# EAGLE design panel (EAGLE 9.6.1)
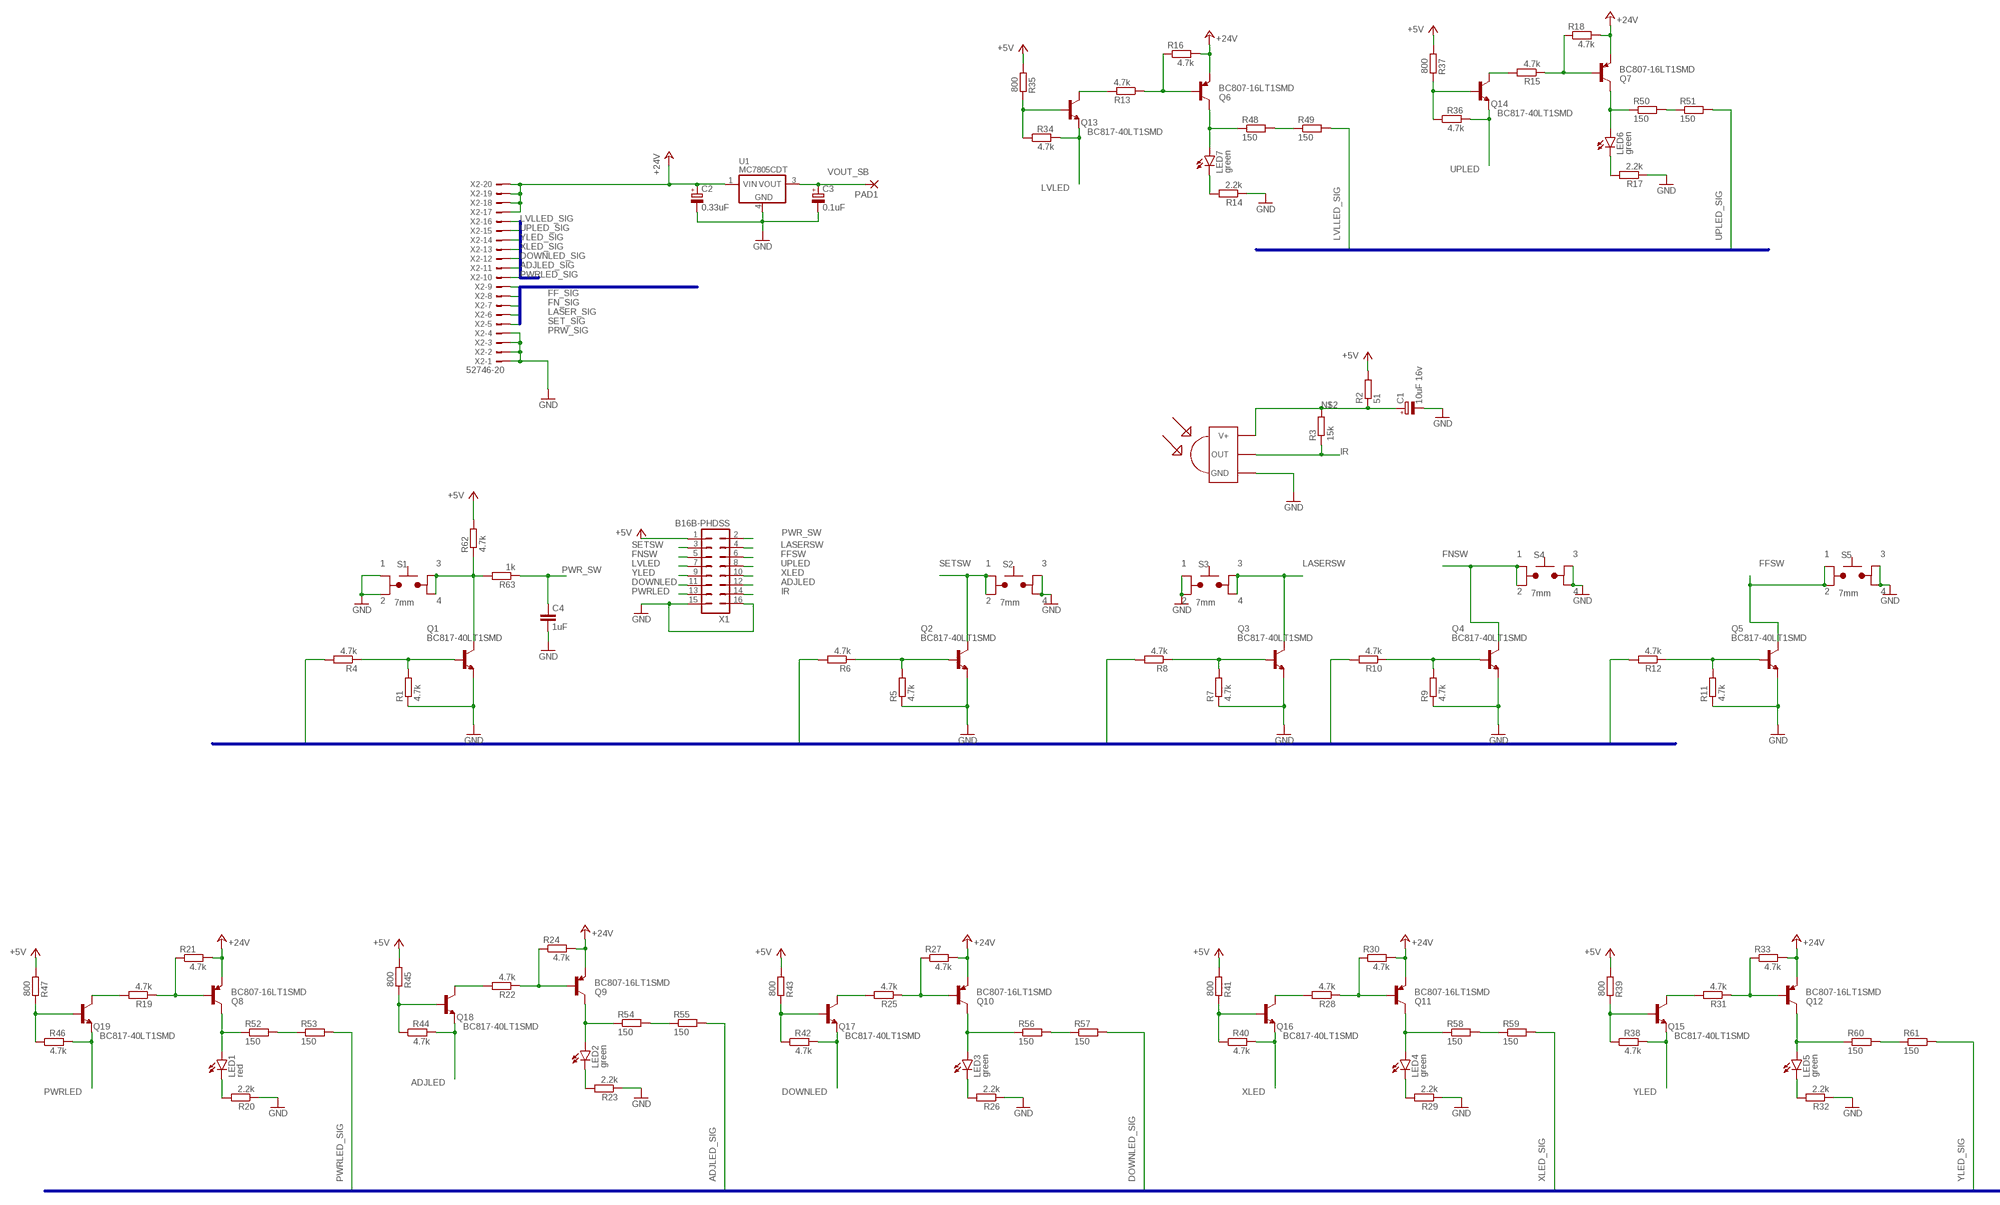
[diagram p0: schematic, sheet 1]

## Parts
C1  10uF 16v  CPOL-EUCT3216  [CT3216]
C2  0.33uF  CPOL-EUCT3216  [CT3216]
C3  0.1uF  CPOL-EUCT3216  [CT3216]
C4  1uF  C-EUC0805  [C0805]
LED1  red  LEDRED_3MM  [LED_RED_3MM]
LED2  green  LEDGREEN_3MM  [LED_GREEN_3MM]
LED3  green  LEDGREEN_3MM  [LED_GREEN_3MM]
LED4  green  LEDGREEN_3MM  [LED_GREEN_3MM]
LED5  green  LEDGREEN_3MM  [LED_GREEN_3MM]
LED6  green  LEDGREEN_3MM  [LED_GREEN_3MM]
LED7  green  LEDGREEN_3MM  [LED_GREEN_3MM]
PAD1  1,6/0,8  [1,6/0,8]
Q1  BC817-40LT1SMD  [SOT23-BEC]
Q2  BC817-40LT1SMD  [SOT23-BEC]
Q3  BC817-40LT1SMD  [SOT23-BEC]
Q4  BC817-40LT1SMD  [SOT23-BEC]
Q5  BC817-40LT1SMD  [SOT23-BEC]
Q6  BC807-16LT1SMD  [SOT23]
Q7  BC807-16LT1SMD  [SOT23]
Q8  BC807-16LT1SMD  [SOT23]
Q9  BC807-16LT1SMD  [SOT23]
Q10  BC807-16LT1SMD  [SOT23]
Q11  BC807-16LT1SMD  [SOT23]
Q12  BC807-16LT1SMD  [SOT23]
Q13  BC817-40LT1SMD  [SOT23-BEC]
Q14  BC817-40LT1SMD  [SOT23-BEC]
Q15  BC817-40LT1SMD  [SOT23-BEC]
Q16  BC817-40LT1SMD  [SOT23-BEC]
Q17  BC817-40LT1SMD  [SOT23-BEC]
Q18  BC817-40LT1SMD  [SOT23-BEC]
Q19  BC817-40LT1SMD  [SOT23-BEC]
R1  4.7k  R-EU_R0805  [R0805]
R2  51  R-EU_R0805  [R0805]
R3  15k  R-EU_R0805  [R0805]
R4  4.7k  R-EU_R0805  [R0805]
R5  4.7k  R-EU_R0805  [R0805]
R6  4.7k  R-EU_R0805  [R0805]
R7  4.7k  R-EU_R0805  [R0805]
R8  4.7k  R-EU_R0805  [R0805]
R9  4.7k  R-EU_R0805  [R0805]
R10  4.7k  R-EU_R0805  [R0805]
R11  4.7k  R-EU_R0805  [R0805]
R12  4.7k  R-EU_R0805  [R0805]
R13  4.7k  R-EU_R0805  [R0805]
R14  2.2k  R-EU_R0805  [R0805]
R15  4.7k  R-EU_R0805  [R0805]
R16  4.7k  R-EU_R0805  [R0805]
R17  2.2k  R-EU_R0805  [R0805]
R18  4.7k  R-EU_R0805  [R0805]
R19  4.7k  R-EU_R0805  [R0805]
R20  2.2k  R-EU_R0805  [R0805]
R21  4.7k  R-EU_R0805  [R0805]
R22  4.7k  R-EU_R0805  [R0805]
R23  2.2k  R-EU_R0805  [R0805]
R24  4.7k  R-EU_R0805  [R0805]
R25  4.7k  R-EU_R0805  [R0805]
R26  2.2k  R-EU_R0805  [R0805]
R27  4.7k  R-EU_R0805  [R0805]
R28  4.7k  R-EU_R0805  [R0805]
R29  2.2k  R-EU_R0805  [R0805]
R30  4.7k  R-EU_R0805  [R0805]
R31  4.7k  R-EU_R0805  [R0805]
R32  2.2k  R-EU_R0805  [R0805]
R33  4.7k  R-EU_R0805  [R0805]
R34  4.7k  R-EU_R0805  [R0805]
R35  800  R-EU_R0805  [R0805]
R36  4.7k  R-EU_R0805  [R0805]
R37  800  R-EU_R0805  [R0805]
R38  4.7k  R-EU_R0805  [R0805]
R39  800  R-EU_R0805  [R0805]
R40  4.7k  R-EU_R0805  [R0805]
R41  800  R-EU_R0805  [R0805]
R42  4.7k  R-EU_R0805  [R0805]
R43  800  R-EU_R0805  [R0805]
R44  4.7k  R-EU_R0805  [R0805]
R45  800  R-EU_R0805  [R0805]
R46  4.7k  R-EU_R0805  [R0805]
R47  800  R-EU_R0805  [R0805]
R48  150  R-EU_R2512  [R2512]
R49  150  R-EU_R2512  [R2512]
R50  150  R-EU_R2512  [R2512]
R51  150  R-EU_R2512  [R2512]
R52  150  R-EU_R2512  [R2512]
R53  150  R-EU_R2512  [R2512]
R54  150  R-EU_R2512  [R2512]
R55  150  R-EU_R2512  [R2512]
R56  150  R-EU_R2512  [R2512]
R57  150  R-EU_R2512  [R2512]
R58  150  R-EU_R2512  [R2512]
R59  150  R-EU_R2512  [R2512]
R60  150  R-EU_R2512  [R2512]
R61  150  R-EU_R2512  [R2512]
R62  4.7k  R-EU_R0805  [R0805]
R63  1k  R-EU_R0805  [R0805]
S1  7mm  TL11057MM  [TL1105F]
S2  7mm  TL11057MM  [TL1105F]
S3  7mm  TL11057MM  [TL1105F]
S4  7mm  TL11057MM  [TL1105F]
S5  7mm  TL11057MM  [TL1105F]
U1  MC7805CDT  [DPAK-3]
U$1  TSOP4838FLAT  [HDRVR14W64P250_1X14_2266X508X754B]
X1  B16B-PHDSS  [B16B-PHDSS]
X2  52746-20  [52746-20]

## Nets
+5V: R2.2 R35.1 R37.1 R39.1 R41.1 R43.1 R45.1 R47.1 R62.2 X1.1
+24V: C2.+ Q6.2(E) Q7.2(E) Q8.2(E) Q9.2(E) Q10.2(E) Q11.2(E) Q12.2(E) R16.2 R18.2 R21.2 R24.2 R27.2 R30.2 R33.2 U1.1(VIN) X2.17 X2.18 X2.19 X2.20
ADJLED [signal]: Q18.E R44.2 X1.12
ADJLED_SIG: R55.2 X2.11
DOWNLED [signal]: Q17.E R42.2 X1.11
DOWNLED_SIG: R57.2 X2.12
FF_SIG: R12.2 X2.9
FFSW [signal]: Q5.C S5.1 S5.3 X1.6
FN_SIG: R10.2 X2.8
FNSW [signal]: Q4.C S4.1 S4.3 X1.5
GND [supply]: C1.- C2.- C3.- C4.2 Q1.E Q2.E Q3.E Q4.E Q5.E R1.1 R5.1 R7.1 R9.1 R11.1 R14.1 R17.1 R20.1 R23.1 R26.1 R29.1 R32.1 S1.1 S1.3 S2.2 S2.4 S3.1 S3.3 S4.2 S4.4 S5.2 S5.4 U1.4(GND) U$1.GND X1.15 X1.16 X2.1 X2.2 X2.3 X2.4
IR [signal]: R3.1 U$1.OUT X1.14
LASER_SIG: R8.2 X2.7
LASERSW [signal]: Q3.C S3.2 S3.4 X1.4
LVLED [signal]: Q13.E R34.2 X1.7
LVLLED_SIG: R49.2 X2.16
N$1: Q1.B R1.2 R4.1
N$2: C1.+ R2.1 R3.2 U$1.VCC(V+)
N$3: LED7.A Q6.3(C) R48.1
N$4: Q2.B R5.2 R6.1
N$5: Q3.B R7.2 R8.1
N$6: Q4.B R9.2 R10.1
N$7: Q5.B R11.2 R12.1
N$8: Q6.1(B) R13.1 R16.1
N$9: Q13.C R13.2
N$10: LED7.K(C) R14.2
N$11: Q14.B R36.1 R37.2
N$12: Q7.1(B) R15.1 R18.1
N$13: LED6.K(C) R17.2
N$14: Q8.1(B) R19.1 R21.1
N$15: LED1.K(C) R20.2
N$16: Q9.1(B) R22.1 R24.1
N$17: LED2.K(C) R23.2
N$18: Q10.1(B) R25.1 R27.1
N$19: LED3.K(C) R26.2
N$20: Q11.1(B) R28.1 R30.1
N$21: LED4.K(C) R29.2
N$22: Q12.1(B) R31.1 R33.1
N$23: LED5.K(C) R32.2
N$24: Q13.B R34.1 R35.2
N$25: Q14.C R15.2
N$26: Q15.B R38.1 R39.2
N$27: Q15.C R31.2
N$28: Q16.B R40.1 R41.2
N$29: Q16.C R28.2
N$30: Q17.B R42.1 R43.2
N$31: Q17.C R25.2
N$32: Q18.B R44.1 R45.2
N$33: Q18.C R22.2
N$34: Q19.B R46.1 R47.2
N$35: Q19.C R19.2
N$36: R48.2 R49.1
N$37: LED6.A Q7.3(C) R50.1
N$38: R50.2 R51.1
N$39: LED1.A Q8.3(C) R52.1
N$40: R52.2 R53.1
N$41: LED2.A Q9.3(C) R54.1
N$42: R54.2 R55.1
N$43: LED3.A Q10.3(C) R56.1
N$44: R56.2 R57.1
N$45: LED4.A Q11.3(C) R58.1
N$46: R58.2 R59.1
N$47: LED5.A Q12.3(C) R60.1
N$48: R60.2 R61.1
N$49 [signal]: Q1.C R62.1 R63.2 S1.2 S1.4
PRW_SIG: R4.2 X2.5
PWR_SW [signal]: C4.1 R63.1 X1.2
PWRLED [signal]: Q19.E R46.2 X1.13
PWRLED_SIG: R53.2 X2.10
SET_SIG: R6.2 X2.6
SETSW [signal]: Q2.C S2.1 S2.3 X1.3
UPLED [signal]: Q14.E R36.2 X1.8
UPLED_SIG: R51.2 X2.15
VOUT_SB: C3.+ PAD1.1(P) U1.3(VOUT)
XLED [signal]: Q16.E R40.2 X1.10
XLED_SIG: R59.2 X2.13
YLED [signal]: Q15.E R38.2 X1.9
YLED_SIG: R61.2 X2.14

## Buses
B$1,FF_SIG,FN_SIG,LASER_SIG,PRW_SIG,SET_SIG
ADJLED_SIG,DOWNLED_SIG,LVLLED_SIG,PWRLED_SIG,UPLED_SIG,XLED_SIG,YLED_SIG
FF_SIG,FN_SIG,LASER_SIG,PRW_SIG,SET_SIG

## Library data of the parts
C1-C3 = rcl:CPOL-EU: POLARIZED CAPACITOR, European symbol; SPICEPREFIX: C
C4 = rcl:C-EU: CAPACITOR, European symbol; SPICEPREFIX: C
LED1-LED7 = led_user:LED: LED OSRAM: - CHIPLED LG R971, LG N971, LY N971, LG Q971, LY Q971, LO R971, LY R971 LH N974, LH R974 LS Q976, LO Q976, LY Q976 LO Q996 - Hyper CHIPLED LW Q18S LB Q993, LB Q99A, LB R99A - SideLED LS A670, LO A670, LY A670, LG A670, LP A670 LB A673, LV A673, LT A673, LW A673 LH A674 LY A675 LS A676, LA A676, LO A676, LY A676, LW A676 LS A679, LY A679, LG A679 - Hyper Micro SIDELED® LS Y876, LA Y876, LO Y876, LY Y876 LT Y87S - SmartLED LW L88C, LW L88S LB L89C, LB L89S, LG L890 LS L89K, LO L89K, LY L89K LS L896, LA L896, LO L896, LY L896 - TOPLED LS T670, LO T670, LY T670, LG T670, LP T670 LSG T670, LSP T670, LSY T670, LOP T670, LYG T670 LG T671, LOG T671, LSG T671 LB T673, LV T673, LT T673, LW T673 LH T674 LS T676, LA T676, LO T676, LY T676, LB T676, LH T676, LSB T676, LW T676 LB T67C, LV T67C, LT T67C, LS T67K, LO T67K, LY T67K, LW E67C LS E67B, LA E67B, LO E67B, LY E67B, LB E67C, LV E67C, LT E67C LW T67C LS T679, LY T679, LG T679 LS T770, LO T770, LY T770, LG T770, LP T770 LB T773, LV T773, LT T773, LW T773 LH T774 LS E675, LA E675, LY E675, LS T675 LS T776, LA T776, LO T776, LY T776, LB T776 LHGB T686 LT T68C, LB T68C - Hyper Mini TOPLED® LB M676 - Mini TOPLED Santana® LG M470 LS M47K, LO M47K, LY M47K Source: http://www.osram.convergy.de LUXEON: - LUMILED® LXK2-PW12-R00, LXK2-PW12-S00, LXK2-PW14-U00, LXK2-PW14-V00 LXK2-PM12-R00, LXK2-PM12-S00, LXK2-PM14-U00 LXK2-PE12-Q00, LXK2-PE12-R00, LXK2-PE12-S00, LXK2-PE14-T00, LXK2-PE14-U00 LXK2-PB12-K00, LXK2-PB12-L00, LXK2-PB12-M00, LXK2-PB14-N00, LXK2-PB14-P00, LXK2-PB14-Q00 LXK2-PR12-L00, LXK2-PR12-M00, LXK2-PR14-Q00, LXK2-PR14-R00 LXK2-PD12-Q00, LXK2-PD12-R00, LXK2-PD12-S00 LXK2-PH12-R00, LXK2-PH12-S00 LXK2-PL12-P00, LXK2-PL12-Q00, LXK2-PL12-R00 Source: www.luxeon.com KINGBRIGHT: KA-3528ASYC Source: www.kingbright.com
PAD1 = wirepad:1,6/0,8: THROUGH-HOLE PAD
Q1-Q5 Q13-Q19 = transistor-npn:BC817*: NPN Transistor
Q6-Q12 = transistor-pnp_user:BC807*: PNP Transistror
R1-R63 = rcl:R-EU_: RESISTOR, European symbol; SPICEPREFIX: R
S1-S5 = switch_user:TL1105
U1 = _hhn_78xx_79xx_NCV78xx_d2pak_dpak:MC78*: 78xx SMD (D2PAK, DPAK) (MC)78xx..DT (DPAK-3; Rth,JA = 92 K/W) (MC)78xx..D2T (D2PAK-3; Rth,JA = 45 K/W @ 10x10mm copper area) Linear Voltage Regulators, Positive, 1 A (ON Semiconductor) Package dimenisions and soldering footprints acc. to ONSEMI specs. Source: http://onsemi.com Datasheet document#: MC7800/D Technologies: 78xxyD(2)Tz: xx = Output Voltage (V) y, z: additional suffixes see manufacturer's datasheet Author: Dipl.-Ing. FH Rainer Bayer HHN Hochschule Heilbronn, rainer.bayer@hs-heilbronn.de Ingenieurbüro ing-rb, mail@ing-rb.de
U$1 = tsop:TSOP4838: IR Receiver and Demodulator
X1 = con-JST PHD:B16B-PHDSS: JST PHD series header 2.00mm pitch disconnectable crimp style connectors, vertical (side entry type), 16 pins
X2 = con-molex_user:52746-20: FPC Connector ZIF for SMT 0.5mm Source: http://www.farnell.com/datasheets/73044.pdf [DWG. NO. (Sheet 1 OF 2) SD-52746-**17] Distributor: Farnell 9786350; MF: MOLEX; OC_FARNELL: 9786350; OC_NEWARK: unknown

## Net classes
1 supply: width 0.254 mm, clearance 0.127 mm
2 signal: width 0.254 mm, clearance 0.254 mm

## Board
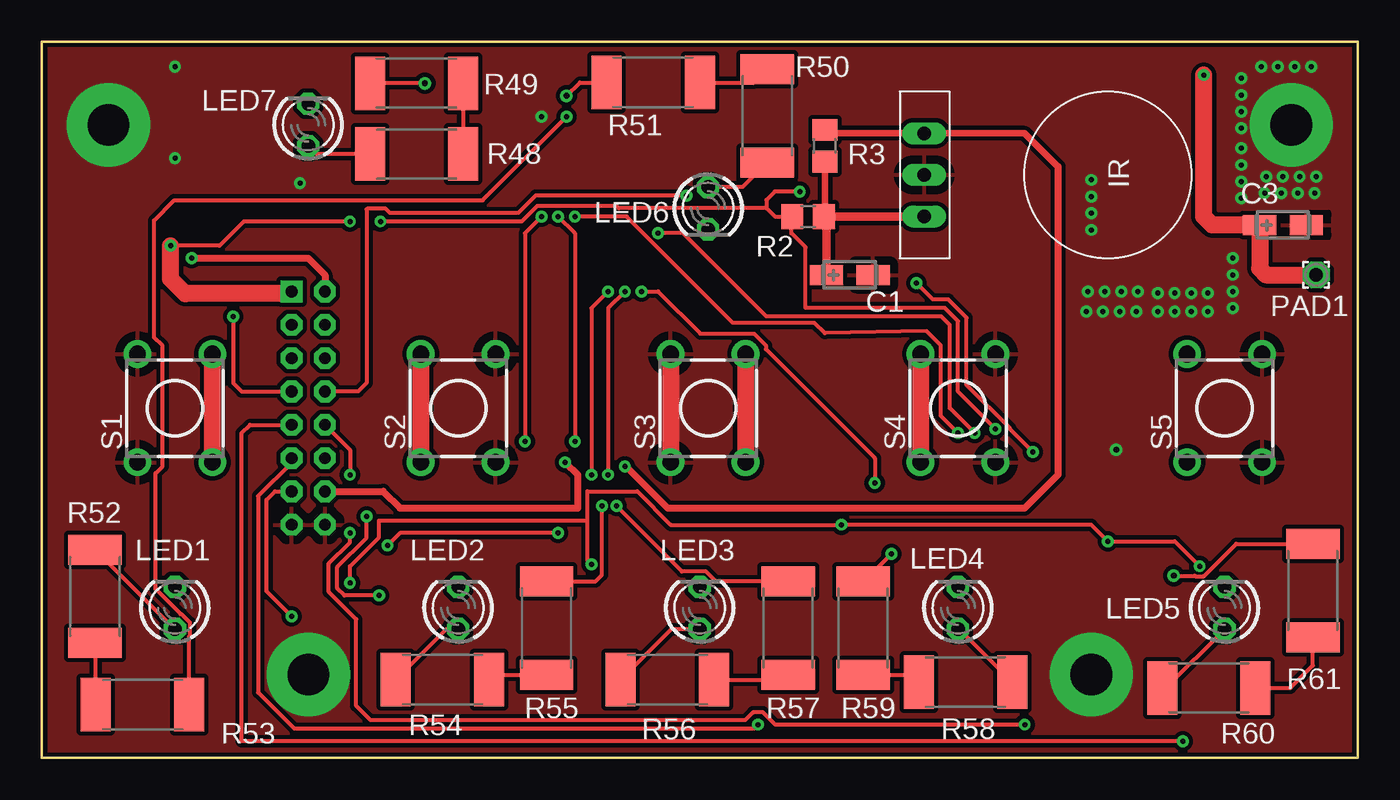
[diagram p1: board, top side]
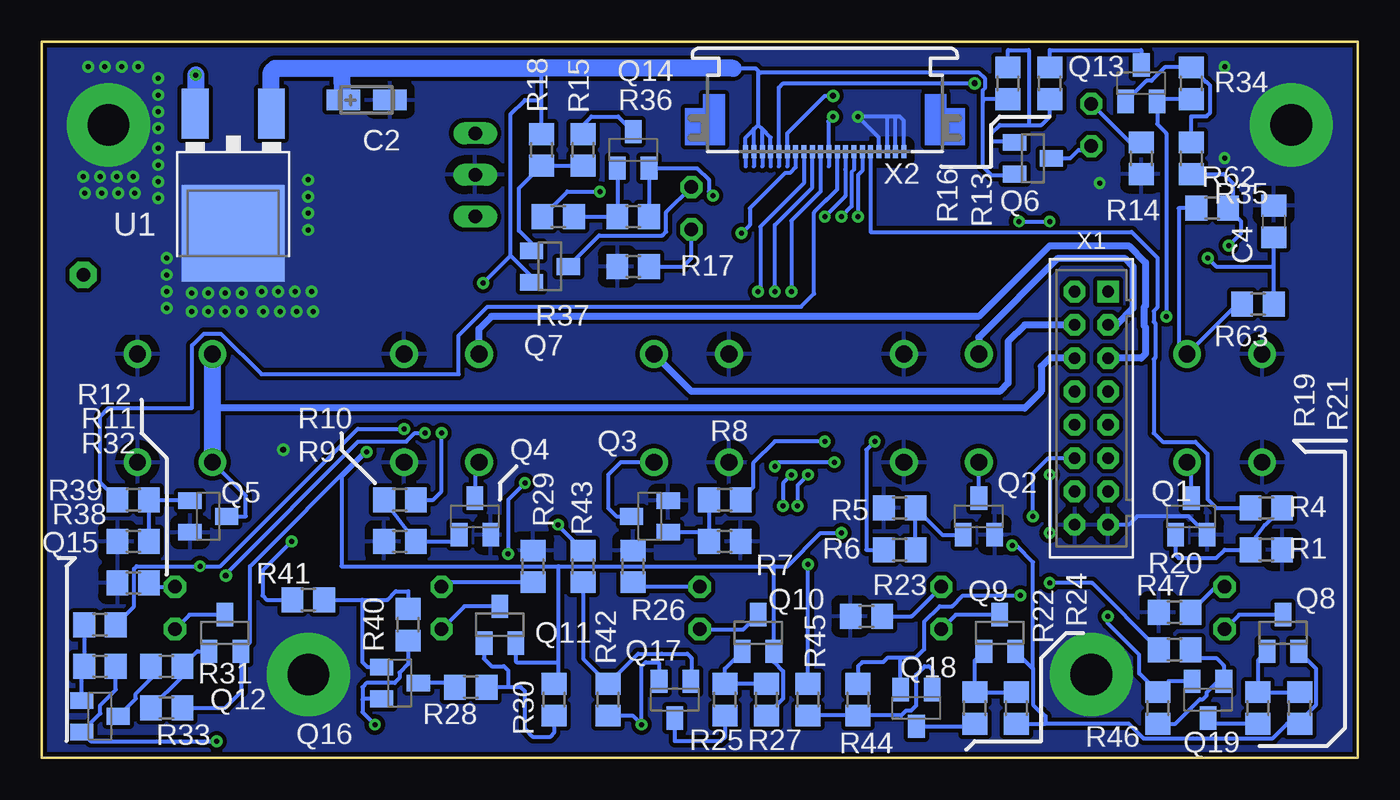
[diagram p2: board, bottom side, seen from below]

Size 79 x 43 mm. Coordinates in mm from the lower left corner, seen from the top.
Outline: 0,43 0,0 79,0 79,43 0,43
Copper layers (1*16): Top 0.035mm / dielectric 1.5mm / Bottom 0.035mm
Design rules "default *": minimum track width 10mil, minimum drill 0.3mm, track to track 5mil, track to pad 5mil, pad to pad 5mil, via to via 5mil, smd to smd 5mil, copper to edge 10mil, drill to drill 6mil, minimum pad ring 10mil, minimum via ring 8mil, stop-mask expansion 4mil, vias tented up to drill 0mil, thermal gap 20mil

### Footprints (pad centres in the part's own frame; a part is rotated, then mirrored left to right if it is on the bottom)
CT3216 = smd 2 x 1.2: + -1.4,0; - 1.4,0
C0805 = smd 1.3 x 1.5: 1 -0.95,0; 2 0.95,0
LED_RED_3MM = drill 0.813 octagon: A -1.27,0; K 1.27,0
LED_GREEN_3MM = drill 0.813 octagon: A -1.27,0; K 1.27,0
1,6/0,8 = drill 0.813 pad 1.6 octagon: 1 0,0
SOT23-BEC = smd 1 x 1.4: B -0.95,-1.1; C 0,1.1; E 0.95,-1.1
SOT23 = smd 1 x 1.4: 1 -0.95,-1.1; 2 0.95,-1.1; 3 0,1.1
R0805 = smd 1.3 x 1.5: 1 -0.95,0; 2 0.95,0
R2512 = smd 1.8 x 3.2: 1 -2.8,0; 2 2.8,0
TL1105F = drill 1 pad 1.676: 1 -2.25,3.25; 2 2.25,3.25; 3 -2.25,-3.25; 4 2.25,-3.25
DPAK-3 = smd 1.6 x 3: 1 -2.286,-7.18; 3 2.286,-7.18 | smd 6.2 x 5.8: 4 0,0
HDRVR14W64P250_1X14_2266X508X754B = drill 0.813 long: GND -0.001,-0.027; OUT -2.501,-0.027; VCC 2.499,-0.027
B16B-PHDSS = drill 0.7 pad 1.3 square: 1 7,-1 | drill 0.7 pad 1.3 octagon: 2 7,1; 3 5,-1; 4 5,1; 5 3,-1; 6 3,1; 7 1,-1; 8 1,1; 9 -1,-1; 10 -1,1; 11 -3,-1; 12 -3,1; 13 -5,-1; 14 -5,1; 15 -7,-1; 16 -7,1
52746-20 = smd 0.3 x 0.8: 1 -4.75,0.6; 2 -4.25,0.6; 3 -3.75,0.6; 4 -3.25,0.6; 5 -2.75,0.6; 6 -2.25,0.6; 7 -1.75,0.6; 8 -1.25,0.6; 9 -0.75,0.6; 10 -0.25,0.6; 11 0.25,0.6; 12 0.75,0.6; 13 1.25,0.6; 14 1.75,0.6; 15 2.25,0.6; 16 2.75,0.6; 17 3.25,0.6; 18 3.75,0.6; 19 4.25,0.6; 20 4.75,0.6

### Placement (x,y rotation side)
C1  48.5,29 0 top
C2  59.5,39.5 0 bottom
C3  74.5,32 0 top
C4  5.05,32.2 90 bottom
LED1  8,9 90 top
LED2  25,9 90 top
LED3  39.5,9 90 top
LED4  55,9 90 top
LED5  71,9 90 top
LED6  40,33 270 top
LED7  16,38 90 top
PAD1  76.5,29 0 top
Q1  10,14.5 0 bottom
Q2  22.75,14.5 0 bottom
Q3  42.5,14.5 90 bottom
Q4  53,14.5 0 bottom
Q5  69,14.5 270 bottom
Q6  19.5,36 270 bottom
Q7  48.5,29.5 270 bottom
Q8  4.5,7.5 0 bottom
Q9  21.5,7.5 0 bottom
Q10  36,7.5 0 bottom
Q11  51.5,8 0 bottom
Q12  68,7.5 0 bottom
Q13  13,40.5 0 bottom
Q14  43.5,36.5 0 bottom
Q15  75.5,2.5 270 bottom
Q16  57.5,4.5 270 bottom
Q17  41,3.5 180 bottom
Q18  26.5,3 180 bottom
Q19  9,3.5 180 bottom
R1  5.5,12.5 180 bottom
R2  46,32.5 180 top
R3  47,36.75 270 top
R4  5.5,15 180 bottom
R5  27.5,15 0 bottom
R6  27.5,12.5 180 bottom
R7  38,13 180 bottom
R8  38,15.5 0 bottom
R9  57.5,13 0 bottom
R10  57.5,15.5 0 bottom
R11  73.5,13 0 bottom
R12  73.5,15.5 180 bottom
R13  18.5,40.5 90 bottom
R14  13,36 90 bottom
R15  46.5,36.5 90 bottom
R16  21,40.5 270 bottom
R17  43.5,29.5 0 bottom
R18  49,36.5 90 bottom
R19  6,3 270 bottom
R20  11,8.75 0 bottom
R21  3.5,3 270 bottom
R22  23,3 270 bottom
R23  29.5,8.5 0 bottom
R24  20.5,3 270 bottom
R25  38,3.5 270 bottom
R26  43.5,11.5 270 bottom
R27  35.5,3.5 270 bottom
R28  53.25,4.25 180 bottom
R29  49.5,11.5 270 bottom
R30  48.25,3.5 90 bottom
R31  71.5,5.5 180 bottom
R32  73.5,10.5 0 bottom
R33  71.5,3 0 bottom
R34  10,40.5 270 bottom
R35  10,36 90 bottom
R36  43.5,32.5 0 bottom
R37  48,32.5 0 bottom
R38  75.5,5.5 0 bottom
R39  75.5,8 180 bottom
R40  57,8 270 bottom
R41  63,9.5 0 bottom
R42  45,3.5 270 bottom
R43  46.5,11.5 270 bottom
R44  30,3.5 90 bottom
R45  33,3.5 270 bottom
R46  12,3 90 bottom
R47  11,6.5 0 bottom
R48  22.5,36.25 0 top
R49  22.5,40.5 180 top
R50  43.55,38.55 90 top
R51  36.7,40.55 180 top
R52  3.2,9.7 270 top
R53  6.05,3.2 0 top
R54  24.05,4.7 0 top
R55  30.3,7.8 90 top
R56  37.55,4.7 0 top
R57  44.8,7.8 90 top
R58  55.45,4.55 180 top
R59  49.3,7.8 90 top
R60  70.05,4.2 0 top
R61  76.3,10.05 90 top
R62  8.75,33 0 bottom
R63  6,27.25 180 bottom
S1  8,21 0 top
S2  25,21 0 top
S3  40,21 0 top
S4  55,21 0 top
S5  71,21 0 top
U1  67.5,31.5 180 bottom
U$1  53,35 270 top
X1  16,21 90 bottom
X2  32,37 180 bottom

### Tracks (layer width: path | path; a pad name or v marks a point on that pad's centre or on a via)
+5V  (via drill 0.3)
  Top 0.254: v45.5,34 44,34 43.5,33.5 43.5,33 | 43.5,33 44,32.5 R2.2 45,32.45 45,31.5 45.85,30.65 45.85,27.01 54.21,27.01 55.01,26.21 55.01,21.99 v57.25,19.75 | v20.34,32.2 28.81,32.2 29.74,33.13 34.51,33.13 34.64,33 43.5,33 | v7.74,30.75 10.68,30.75 12.13,32.2 v18.5,32.2 | v69.5,11.5 68,13 v64,13 63,14 v48,14 37.75,14 35.75,16 32.75,16 32.75,14.25 | 32.75,14.25 20.25,14.25 20.25,13.25 18.5,11.5 v18.5,10.5 | v33,11.62 32.75,11.87 32.75,14.25
  Top 1.016: X1.1 14.88,27.88 8.62,27.88 7.74,28.76 v7.74,30.75
  Bottom 0.254: R37.1 47.45,34 v45.5,34 | v20.34,32.2 v18.5,32.2 | R39.1 73.45,9.1 73.45,11.36 73.31,11.5 v69.5,11.5 68.28,11.5 60.03,19.75 v57.25,19.75 | R43.1 48,13.95 v48,14 | R45.1 v33,11.62 | R47.1 15.95,10.5 v18.5,10.5 | v64,13 65.75,11.25 65.75,9.75 65.5,9.5 R41.1 | R35.1 8.05,35.05 7.5,34.5 7.5,33.3 R62.2 7,32.2 7,31.49 v7.74,30.75
+24V  (via drill 0.3)
  Top 0.254: v59.5,18.36 58.13,19.73 58.13,19.76 55.52,22.38 55.52,26.42 54.42,27.52 53.48,27.52 v52.5,28.5 | v31,13.5 21.5,13.5 v20.75,12.75
  Bottom 0.254: 36.25,37.75 36.75,37.25 X2.20 36.75,35.5 | 36.25,37.75 X2.19 36.25,35.5 | 36.25,37.75 36,38 | 35.75,37.75 X2.18 35.75,35.5 | 35.75,37.75 36,38 | 35.75,37.75 35.25,37.25 X2.17 35.25,35.5 | Q6.2 20.65,35 22,35 22.5,35.5 22.5,39.41 | R18.2 49,39.5 | 49,39.5 49,41.4 | Q7.2 49.6,28.89 50.85,30.14 | 50.85,30.14 50.86,30.15 50.86,38.64 50,39.5 49,39.5 | R33.2 68,3 67,4 67,6.35 Q12.2 66.5,6.95 66.5,11.5 59.64,18.36 v59.5,18.36 61,16.86 61,11.5 48,11.5 | v52.5,28.5 50.85,30.14 | 48,11.5 35,11.5 | 35,11.5 34.25,11.5 32.25,13.5 v31,13.5 | R27.2 34.5,3.55 34.5,5.21 35.05,5.76 Q10.2 35.05,11.45 35,11.5 | Q9.2 19.5,5.35 | 19.5,5.35 19.5,3.19 19.05,2.75 19,2.75 18.75,2.5 18.75,2.05 | 19.5,5.35 19.5,11.75 20.5,12.75 v20.75,12.75 | R16.2 22.36,39.55 22.5,39.41 | Q8.2 2.5,5.35 2.5,3.19 3.5,2.19 R21.2 4.24,2.05 5.14,1.15 12.86,1.15 13.76,2.05 18.75,2.05 | 36,41.25 36.15,41.4 37.5,41.4 | 36,41.25 36,38 | 36,41.25 35.88,41.13 22.74,41.13 22.37,40.76 22.37,40.24 22.5,40.11 22.5,39.41 | R30.2 48,4.7 48,5.75 | 48,11.5 48,5.75 | Q11.2 50.55,5.8 50.5,5.75 48,5.75 | R24.2 18.75,2.05
  Bottom 1.016: U1.1 65.21,41.19 65,41.4 61,41.4 | 61,41.4 49,41.4 37.5,41.4 | C2.+ 61,41.4
ADJLED  (via drill 0.3)
  Top 0.254: v19.5,14.5 19.5,13.22 17.74,11.46 17.74,10.19 18.18,9.75 v20.25,9.75
  Bottom 0.254: v19.5,14.5 19.5,17.07 18.57,18 X1.12 | v20.25,9.75 23.7,9.75 24.34,9.11 25.09,9.11 26.04,8.16 26.04,6.51 26.55,6 27.5,6 | 27.5,6 28.25,6 28.5,5.75 29.75,5.75 30,5.5 R44.2 | Q18.E 27.45,5.95 27.5,6
ADJLED_SIG  (via drill 0.3)
  Top 0.254: v33.63,15.12 33.63,10.99 33.25,10.6 R55.2 | v34,28 33,27 v33,17
  Bottom 0.254: v33,17 33.63,16.37 v33.63,15.12 | X2.11 32.25,34 34,32.25 v34,28
DOWNLED  (via drill 0.3)
  Top 0.254: X1.11 15,17.72 12.99,15.71 12.99,3.93 15.18,1.75 42.75,1.75 v43,2
  Bottom 0.254: Q17.E 41.95,5.7 42,5.75 42.75,5.75 43,5.5 v43,2 43.55,2.55 R42.2
DOWNLED_SIG  (via drill 0.3)
  Top 0.254: v35,28 34,27 v34,17 | R57.2 40.46,10.6 39.88,11.18 38.43,11.18 v34.5,15.12
  Bottom 0.254: v34,17 34.5,16.5 v34.5,15.12 | v35,28 35,32 32.75,34.25 X2.12
FF_SIG
  Bottom 0.254: R12.2 75.5,16.55 75.5,20.5 75,21 70,21 69.97,21.03 69.97,24.75 69.25,25.47 68.25,25.47 65.81,23.03 53.97,23.03 53.97,25.36 52.24,27.08 33.42,27.08 32.63,27.87 32.63,32.76 31.95,33.45 31.87,33.52 31.25,34.14 X2.9
FFSW
  Bottom 0.254: Q5.C 66.75,14.5 66.75,15.75 S5.3
  Bottom 0.406: X1.6 18.5,24 19,23.5 19,22 20,21 68.75,21
  Bottom 1.016: S5.3 68.75,21 S5.1
FN_SIG  (via drill 0.3)
  Top 0.254: v55,19.5 53.97,20.53 53.97,24.75 53.11,25.61 47,25.5 46.38,26.12 41.49,26.12 35.11,32.5 v32,32.5
  Bottom 0.254: R10.2 55.5,15.5 55,16 v55,19.5 | v32,32.5 30.76,33.74 30.76,35.32 30.75,35.33 X2.8
FNSW
  Top 1.016: S4.1 S4.3
  Bottom 0.254: S4.3 53,17.5 Q4.C
  Bottom 0.406: S4.1 52.75,25.75 52,26.5 22.75,26.5 18.5,30.75 13.75,30.75 12.75,29.75 12.75,27.15 12.84,27.06 12.84,25.94 12.75,25.85 12.75,24.25 13,24 X1.5
GND  (via drill 0.3, 0.35, 2.5 pad 5)
  Top 1.016: S3.1 S3.3
  Bottom 0.254: Q1.E 10.15,14.5 13.25,14.5 13.75,14 X1.15 | X2.4 28.75,37.25 v30,38.5 28.25,38.5 | X2.1 27.25,38.25 27.5,38.5 27.75,38.5 | 27.75,38.5 28.25,38.5 | X2.2 27.75,38.5 | X2.3 28.25,38.5
  other vias: 16,5 4,38 63,5 75,38 8,36 15.5,34.5 8,41.5 71.5,30 71.5,29 71.5,28 71.5,27 67,27.9 68,27.9 69,27.9 70,27.9 67,26.8 68,26.8 69,26.8 70,26.8 62.8,28 63.8,28 64.8,28 65.8,28 62.7,26.8 63.7,26.8 64.7,26.8 65.7,26.8 63,34.7 63,33.7 63,32.7 63,31.7 73.2,41.5 74.2,41.5 75.2,41.5 76.2,41.5 72,40.8 72,39.8 72,38.8 72,37.8 72,36.6 72,35.6 72,34.6 72,33.6 73.5,34.9 74.5,34.9 75.5,34.9 76.5,34.9 73.4,33.9 74.4,33.9 75.4,33.9 76.4,33.9 64.5,18.5
  pour Top (isolate 0.254): 0,43 0,0 79,0 79,43
  pour Bottom (isolate 0.254): 0,43 0,0 79,0 79,43
  pour Bottom (isolate 0.254, no thermals): 79,43 61.5,43 61,42.5 61,38 60.5,37.5 55,37.5 55,28.5 58,25.5 79,25.5
  pour Top (isolate 0.254, no thermals): 79,43 55.5,43 55.5,27.5 57,26 79,26 79,31 74.5,31 74,31.5 74,33 79,33
  cutout Bottom: 27,36.75 29.25,36.75 29.25,37.25 27,37.25
GND1
  cutout Bottom: 27,35.5 29.25,35.5 29.25,36 27,36
IR  (via drill 0.3)
  Top 0.381: R3.1 47.27,37.5 U$1.OUT 59,37.5
  Top 0.406: 59,37.5 61,35.5 61,17 59,15 37.58,15 35.08,17.5 v35,17.5 | X1.14 20.5,16 21.5,15 32.17,15 32.17,17 v31.42,17.75
  Bottom 0.254: v31.42,17.75 34.75,17.75 v35,17.5
LASER_SIG  (via drill 0.3)
  Top 0.254: v31,32.5 32,31.5 v32,19
  Bottom 0.254: R8.2 36.3,16.25 36.3,17.7 35,19 v32,19 | X2.7 30.25,35.29 30.38,35.16 30.38,33.12 v31,32.5
LASERSW
  Top 1.016: S3.2 S3.4
  Bottom 0.254: S3.4 44.25,17.75 45,17 45,15 44.5,14.5 Q3.C
  Bottom 0.406: X1.4 20,26 21,25 21,22.5 21.5,22 40,22 S3.2
LVLED  (via drill 0.3)
  Top 0.254: X1.7 12,22 11.5,22.5 v11.5,26.5
  Bottom 0.254: v11.5,26.5 11.5,37.5 12.05,38.05 Q13.E 11.9,39.55 R34.2
LVLLED_SIG  (via drill 0.35)
  Top 0.254: v23,40.5 R49.2
  Bottom 0.254: v23,40.5 34.5,40.5 34.75,40.25 X2.16 34.75,35.5
N$1
  Bottom 0.254: R4.1 5.59,13.96 6.45,12.83 R1.2 8,12.5 8.5,12 10.75,12 10.95,12.2 Q1.B
N$2
  Top 0.381: R3.2 47,32.55 R2.1
  Top 0.508: U$1.VCC R2.1 47.1,32.35 C1.+
N$3
  Top 0.254: R48.1 16.48,36.25 LED7.A
  Bottom 0.254: Q6.3 17.27,36 16.77,36.5 16.23,36.5 LED7.A
N$4
  Bottom 0.254: R6.1 R5.2 24.95,13.4 Q2.B
N$5
  Bottom 0.254: R8.1 R7.2 39.5,13.55 Q3.B
N$6
  Bottom 0.254: Q4.B 54.35,13 R9.2 R10.1
N$7
  Bottom 0.254: Q5.B 72.5,15.45 R12.1 R11.2
N$8
  Bottom 0.254: R16.1 21,42.5 19.75,42.5 19.75,38 | Q6.1 20.65,37 21.99,37 21.99,37.5 21.49,38 19.75,38 | 19.75,38 19,38 18.5,38.5 R13.1
N$9
  Bottom 0.254: R13.2 18.5,42.5 13,42.5 Q13.C
N$10
  Bottom 0.254: LED7.K 13.68,36.95 R14.2
N$11
  Bottom 0.254: Q14.B R36.1 R37.2
N$12
  Bottom 0.254: Q7.1 49.6,30.89 50.35,31.64 50.35,34.2 R18.1 R15.1
N$13
  Bottom 0.254: R17.2 40.5,29.5 40,30 LED6.K
N$14
  Bottom 0.254: Q8.1 6,5.85 R19.1 R21.1
N$15
  Bottom 0.254: R20.2 8.53,10.27 LED1.K
N$16
  Bottom 0.254: Q9.1 23,5.85 R22.1 R24.1
N$17
  Bottom 0.254: R23.2 26.77,8.5 LED2.K
N$18
  Bottom 0.254: Q10.1 38,5.35 R25.1 R27.1
N$19
  Bottom 0.254: LED3.K 43.22,10.27 R26.2
N$20
  Bottom 0.254: R30.1 48.25,1.5 48.5,1.25 49.5,1.25 50,1.75 50,4 50.25,4.25 51,4.25 | 51,4.25 R28.1 | Q11.1 52.45,5.95 52,5.5 51.25,5.5 51,5.25 51,4.25
N$21
  Bottom 0.254: R29.2 54.72,10.55 LED4.K
N$22
  Bottom 0.254: Q12.1 69.65,6.4 R31.1 70.55,4.9 R33.1
N$23
  Bottom 0.254: R32.2 72.32,10.27 LED5.K
N$24
  Bottom 0.254: R35.2 10,38.52 9.09,38.52 8.87,38.74 8.87,40.36 9.09,40.58 9.13,40.58 R34.1 11.59,41.45 12.39,40.65 12.7,40.65 Q13.B
N$25
  Bottom 0.254: R15.2 46.5,38 46,38.5 44.4,38.5 Q14.C
N$26
  Bottom 0.254: R39.2 R38.1 76.6,5.35 Q15.B
N$27
  Bottom 0.254: Q15.C 73.35,3.55 73.35,3.85 72.45,4.76 R31.2
N$28
  Bottom 0.254: R41.2 59.75,9.5 | 59.75,9.5 58.25,9.5 57.75,10 57,10 R40.1 | Q16.B 59.45,5.45 59.75,5.75 59.75,9.5
N$29
  Bottom 0.254: R28.2 54.45,4.5 Q16.C
N$30
  Bottom 0.254: R43.2 46.5,5.95 R42.1 43.19,6.26 41.79,6.26 41.78,6.25 40.25,6.25 40,6 40,4.65 Q17.B
N$31
  Bottom 0.254: R25.2 38,1.25 38.25,1 41,1 Q17.C
N$32
  Bottom 0.254: R45.2 R44.1 27.41,2.55 27.11,2.85 26.8,2.85 26.5,3.15 26.5,5 26,5.5 25.75,5.5 25.55,5.3 Q18.B
N$33
  Bottom 0.254: Q18.C 23.15,1.9 R22.2
N$34
  Bottom 0.254: R46.1 10.95,2.05 9.48,3.52 9.29,3.52 9.07,3.74 9.07,3.93 8.22,4.78 Q19.B 8.05,5.55 8.5,6 9.55,6 R47.2
N$35
  Bottom 0.254: R19.2 8.65,2.05 Q19.C
N$36
  Top 0.254: R49.1 R48.2
N$37
  Top 0.254: R50.1 42.07,34.27 LED6.A
  Bottom 0.254: Q7.3 45.53,31.37 41.74,31.37 41.52,31.59 41.52,32.75 LED6.A
N$38
  Top 0.254: R51.1 42.75,40.55 R50.2
N$39
  Top 0.254: R52.1 7.97,7.73 LED1.A
  Bottom 0.254: Q8.3 7.13,8.6 LED1.A
N$40
  Top 0.254: R53.1 3.25,6.85 R52.2
N$41
  Top 0.254: R54.1 24.28,7.73 LED2.A
  Bottom 0.254: Q9.3 24.13,8.6 LED2.A
N$42
  Top 0.254: R54.2 27.15,5 R55.1
N$43
  Top 0.254: LED3.A 37.78,7.73 R56.1
  Bottom 0.254: LED3.A 36.87,7.73 Q10.3
N$44
  Top 0.254: R56.2 44.5,4.7 R57.1
N$45
  Top 0.254: R58.1 55.07,7.73 LED4.A
  Bottom 0.254: Q11.3 53.63,9.1 LED4.A
N$46
  Top 0.254: R59.1 52.2,5 R58.2
N$47
  Top 0.254: R60.1 67.47,4.2 LED5.A
  Bottom 0.254: Q12.3 70.13,8.6 LED5.A
N$48
  Top 0.254: R60.2 74.95,4.2 76.3,5.55 R61.1
N$49
  Top 1.016: S1.4 S1.2
  Bottom 0.254: Q1.C 10,17.5 S1.4 | 10,24.5 S1.2 | S1.2 7.25,27.25 R63.2 | R62.1 10.75,33 10.75,24.75 S1.2
PRW_SIG
  Bottom 0.254: R4.2 8.5,15 9.03,15.53 9.03,18.25 9.74,18.97 11.72,18.97 12.25,19.5 12.25,23.92 12.17,24.01 12.17,26.09 12.26,26.19 12.26,26.81 12.01,27.07 12.01,30.01 13.57,31.57 29.24,31.57 29.25,31.58 X2.5
PWR_SW  (via drill 0.3)
  Top 0.406: v9,30 16,30 17,29 X1.2
  Bottom 0.254: R63.1 5.05,29.5 | 5.05,29.5 C4.1 | v9,30 8.5,29.5 5.05,29.5
PWRLED  (via drill 0.3)
  Top 0.254: v15.01,8.49 13.5,10 13.5,15.5 14,16 X1.13
  Bottom 0.254: Q19.E 11.35,4.6 R46.2 13.12,5.07 13.12,6.19 15.01,8.09 v15.01,8.49
PWRLED_SIG  (via drill 0.3)
  Top 0.254: v31.5,38.5 26.47,33.47 7.96,33.47 6.75,32.26 6.75,25.25 7.25,24.75 7.25,17.5 6.84,17.09 6.84,10.14 8.33,8.64 8.38,8.64 8.91,8.11 8.91,7.35 8.85,7.29 R53.2
  Bottom 0.254: v31.5,38.5 31.8,38.2 31.75,38.15 X2.10 31.75,35.5
SET_SIG  (via drill 0.3)
  Top 0.254: v29,19 29,31.5 v30,32.5
  Bottom 0.254: R6.2 29.5,12.5 29.5,18.5 v29,19 | v30,32.5 30,35 29.75,35.25 X2.6
SETSW
  Top 1.016: S2.1 S2.3
  Bottom 0.254: Q2.C S2.3
  Bottom 0.406: X1.3 14.5,26 13.5,27 13.5,27.33 13.5,29.5 14,30 18,30 22.75,25.25 S2.1
UPLED  (via drill 0.3)
  Top 0.254: v38.71,33.76 29.65,33.76 28.6,32.71 20.9,32.71 20.65,32.96 19.54,32.96 19.5,32.92 19.5,22.5 19,22 X1.8
  Bottom 0.254: R36.2 Q14.E 39.66,35.4 38.96,34.7 38.96,34.01 v38.71,33.76
UPLED_SIG  (via drill 0.35)
  Top 0.254: v31.5,39.75 32.3,40.55 R51.2
  Bottom 0.254: v31.5,39.75 32,39.75 34.25,37.5 X2.15 34.25,35.5
VOUT_SB  (via drill 0.3)
  Top 1.016: PAD1.1 73.5,29 73.1,29.4 C3.+ 70.25,32 69.75,32.5 v69.75,41
  Bottom 1.016: v69.75,41 69.75,38.72 U1.3
XLED  (via drill 0.3)
  Top 0.254: X1.10 18.5,18.5 v18.5,17 | v59,2 44.04,2 43.3,2.73 42.7,2.73 42.22,2.26 19.74,2.26 18.88,3.12 18.88,8.33 17.23,9.97 17.23,11.67 18.5,12.94 v18.5,13.5
  Bottom 0.254: v18.5,17 v18.5,13.5 | 59.75,3.5 59.75,4.25 59.5,4.5 57.81,4.5 57.52,4.79 57.52,5.12 57,5.64 R40.2 | 59.75,3.5 59.75,2.75 v59,2 | Q16.E 59.7,3.55 59.75,3.5
XLED_SIG  (via drill 0.3)
  Top 0.254: v36,28 37,28 39.53,25.47 42.76,25.47 43.47,24.75 43.47,24.53 50,18 v50,16.5 | R59.2 49.35,10.6 v51,12.25
  Bottom 0.254: X2.13 33.25,34.5 35.87,31.88 35.87,28.13 v36,28 | v50,16.5 51,15.5 v51,12.25
YLED  (via drill 0.3)
  Top 0.254: v68.5,1 12,1 12,19.5 12.5,20 X1.9
  Bottom 0.254: R38.2 74.55,4.09 75.48,3.16 75.48,2.67 Q15.E 76.05,1 v68.5,1
YLED_SIG  (via drill 0.3, 0.35)
  Top 0.254: v56,19.5 54.5,21 54.5,26 54,26.5 43.5,26.5 38.5,31.5 v37,31.5 | R61.2 71.7,12.85 69.75,10.9 69.25,10.9 69.21,10.94 v67.95,10.94
  Bottom 0.254: v56,19.5 56.61,19.5 57.11,18.99 60,18.99 68,10.99 v67.95,10.94 | v37,31.5 36.5,32 36.5,33 34.38,35.12 34.09,35.12 33.75,35.46 X2.14

### Text on the board
200bmp: C:/Users/Puakt/Desktop/20200611_160314.bmp